# Altium schematic sheet Đề19.SchDoc
size A4; SheetNumber: 1; SheetTotal: 1; SPICEModelCacheGZZVKOJT: <root> / <DocumentId>GZZVKOJT</DocumentId> / <CacheFrame Number="0"> / <Model Name="fuse" Kind="CKT"> / <Text>.SUBCKT FUSE 1 2 PARAMS: CURRENT=1 RESISTANCE=1m / SW1 1 2 3 0 SMOD OFF / BNLV 3 0 V=(abs(v(1,2))) / .MODEL SMOD SW (VT={(CURRENT*RESISTANCE)} RON=1g ROFF={RESISTANCE}) / .ENDS FUSE</Text> / </Model> / <Model Name="diode" Kind="MDL"> / <Text>*Default Diode / *Diode Pinout: A,K / .MODEL DIODE D()</Text> / </Model> / <Model Name="skydiode" Kind="MDL"> / <Text>*Default Schottky Diode / *Schottky Diode Pinout: A,K / .MODEL SKYDIODE D(EG=0.69 XTI=2)</Text> / </Model> / <Model Name="irf1010" Kind="CKT"> / <Text>*IRF1010 MCE 4-2-96 / *55V  75A .014 ohm HEXFET pkg:TO-220 2,1,3 / .SUBCKT IRF1010  10 20 40 40 / M1   1  2  3  3  DMOS L=1U W=1U / RD  10  1  5.65M / RS  30  3  1.35M / RG  20  2  12.1 / CGS  2  3  2.15N / EGD 12  0  2  1  1 / VFB 14  0  0 / FFB  2  1  VFB  1 / CGD 13 14  4.49N / R1  13  0  1 / D1  12 13  DLIM / DDG 15 14  DCGD / R2  12 15  1 / D2  15  0  DLIM / DSD  3 10  DSUB / LS  30 40  7.5N / .MODEL DMOS NMOS (LEVEL=3 THETA=60M VMAX=114K ETA=2M VTO=3 KP=19.4) / .MODEL DCGD D (CJO=4.49N VJ=.6 M=.68) / .MODEL DSUB D (IS=311N N=1.5 RS=8.67M BV=55 CJO=4.08N VJ=.8 M=.42 TT=100N) / .MODEL DLIM D (IS=100U) / .ENDS IRF1010</Text> / </Model> / <Model Name="ni3wtrans" Kind="CKT"> / <Text>*Non-ideal 4-winding Transformer / *jjt created 18/1/2001. / *jjt 18/1/2002: changed LX2D,LX3D comments to match subcircuit parameters (X2D, X3D) to avoid possible confusion. / *Connections: / *                 Pri+ / *                 |   Pri- / *                 |   |   Sec1+ / *                 |   |   |   Sec1- / *                 |   |   |   |   Sec2+ / *                 |   |   |   |   |   Sec2- / *                 |   |   |   |   |   | / *                 |   |   |   |   |   | / *                 |   |   |   |   |   | / *                 |   |   |   |   |   | / .SUBCKT NI3WTRANS 1   2   3   4   5   6      PARAMS: RATIO1=1 RATIO2=1 RPRI=0.1 R2D=0.1 R3D=0.1 L1=1U / + X2D=1u X3D=1u XM=1k RCORE=1Meg / VISRC1   4 11 0V / VISRC2   6 14 0V / FCTRL1   10 2 VISRC1 {RATIO1} / FCTRL2   13 2 VISRC2 {RATIO2} / EVCVS1   3 11 10 2 {RATIO1} / EVCVS2   5 14 13 2 {RATIO2} / RRPRI    1 8 {RPRI} / RR2D    9 10 {R2D} / RR3D    12 13 {R3D} / LL1   8 7 {L1} / LX2D  7 9 {X2D} / LX3D  7 12 {X3D} / LXM   7 2 {XM} / RRCORE 7 2 {RCORE} / .ENDS NI3WTRANS</Text> / </Model> / </CacheFrame> / </root>
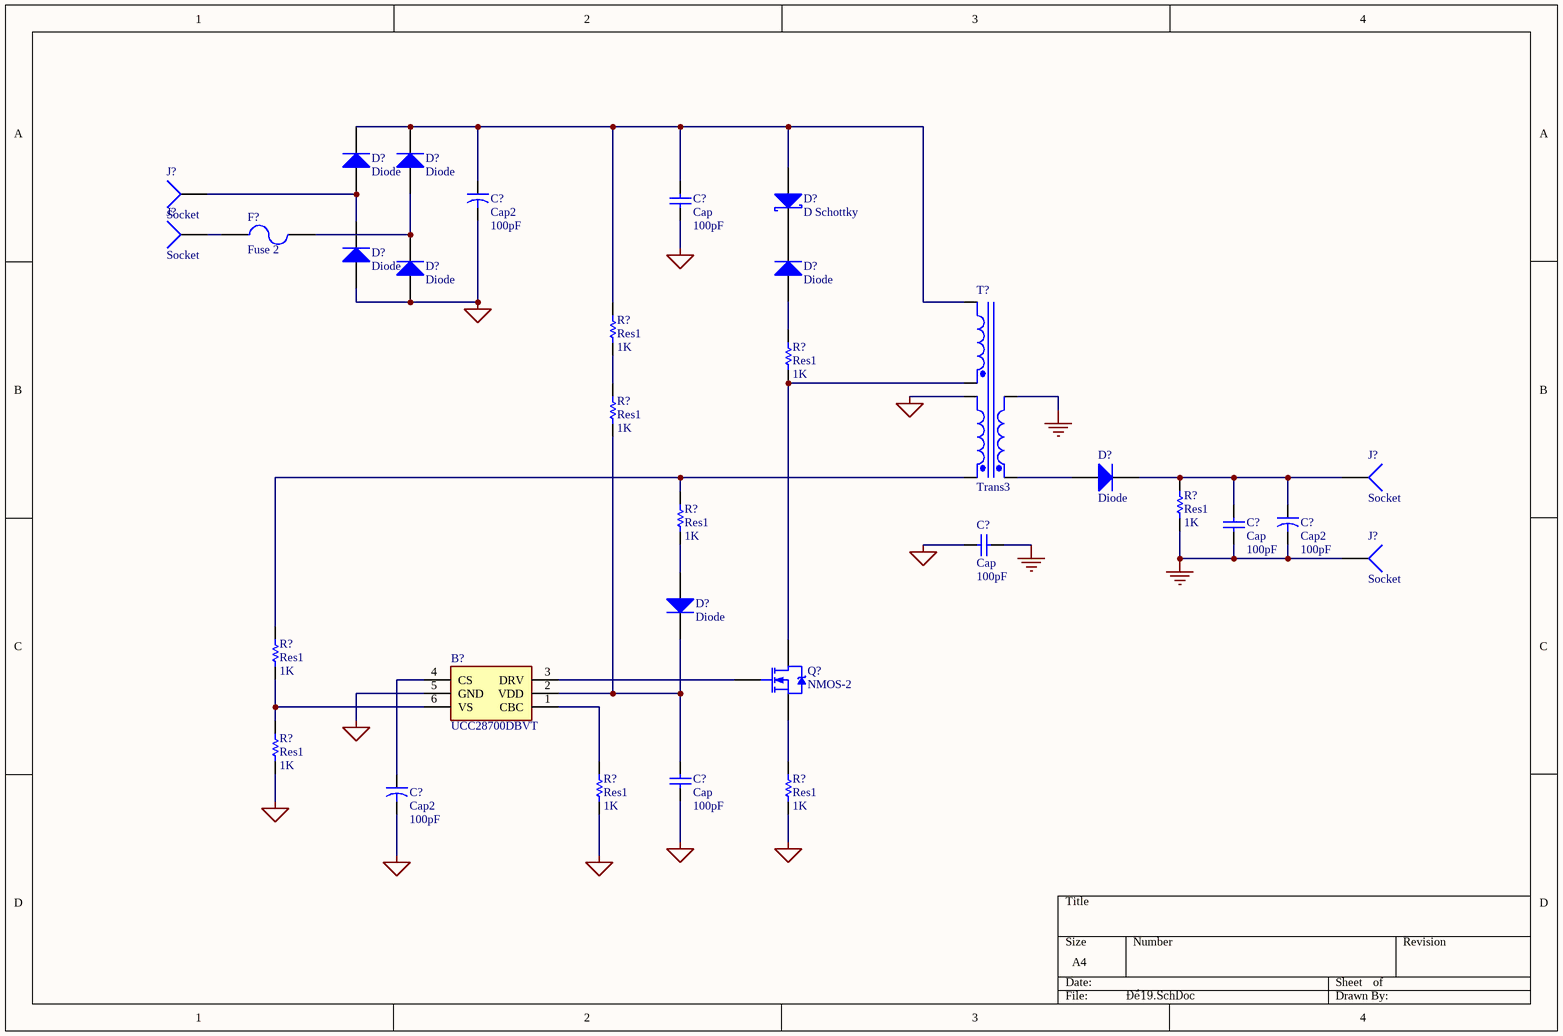
[diagram p0: Đề19.SchDoc]

## Parts
(Parts that share a designator on the sheet are numbered #1, #2 ... from top to bottom, then left to right.)
B?  UCC28700DBVT  [SOT95P280X145-6N]
C?#1  Cap2  value 100pF  [CAPR5-4X5]
C?#2  Cap  value 100pF  [RAD-0.3]
C?#3  Cap2  value 100pF  [CAPR5-4X5]
C?#4  Cap  value 100pF  [RAD-0.3]
C?#5  Cap  value 100pF  [RAD-0.3]
C?#6  Cap2  value 100pF  [CAPR5-4X5]
C?#7  Cap  value 100pF  [RAD-0.3]
D?#1  Diode  [SMC]
D?#2  Diode  [SMC]
D?#3  D Schottky  [SMB]
D?#4  Diode  [SMC]
D?#5  Diode  [SMC]
D?#6  Diode  [SMC]
D?#7  Diode  [SMC]
D?#8  Diode  [SMC]
F?  Fuse 2  [PIN-W2/E2.8]
J?#1  Socket  [PIN1]
J?#2  Socket  [PIN1]
J?#3  Socket  [PIN1]
J?#4  Socket  [PIN1]
Q?  NMOS-2  [TO-220AB]
R?#1  Res1  value 1K  [AXIAL-0.3]
R?#2  Res1  value 1K  [AXIAL-0.3]
R?#3  Res1  value 1K  [AXIAL-0.3]
R?#4  Res1  value 1K  [AXIAL-0.3]
R?#5  Res1  value 1K  [AXIAL-0.3]
R?#6  Res1  value 1K  [AXIAL-0.3]
R?#7  Res1  value 1K  [AXIAL-0.3]
R?#8  Res1  value 1K  [AXIAL-0.3]
R?#9  Res1  value 1K  [AXIAL-0.3]
T?  Trans3  [TRF_6]

## Nets
GND: B?.5(GND) C?#1.2 C?#2.1 C?#3.2 C?#4.1 C?#4.2 C?#5.1 C?#6.2 C?#7.1 D?#4.1(A) D?#5.1(A) J?#4.1 R?#4.1 R?#7.1 R?#8.1 R?#9.1 T?.2(Pri-) T?.4(Sec1-)
NetB?_1: B?.1(CBC) R?#8.2
NetB?_2: B?.2(VDD) C?#7.2 D?#8.2(K) R?#3.1
NetB?_3: B?.3(DRV) Q?.1(G)
NetB?_4: B?.4(CS) C?#6.1
NetB?_6: B?.6(VS) R?#6.1 R?#7.2
NetC?#1_1: C?#1.1 C?#2.2 D?#1.2(K) D?#2.2(K) D?#3.1(A) R?#1.2 T?.6(Sec2-)
NetC?#3_1: C?#3.1 C?#5.2 D?#7.2(K) J?#3.1 R?#4.2
NetD?#1_1: D?#1.1(A) D?#4.2(K) J?#1.1
NetD?#2_1: D?#2.1(A) D?#5.2(K) F?.2
NetD?#3_2: D?#3.2(K) D?#6.2(K)
NetD?#6_1: D?#6.1(A) R?#2.2
NetD?#7_1: D?#7.1(A) T?.1(Pri+)
NetD?#8_1: D?#8.1(A) R?#5.1
NetF?_1: F?.1 J?#2.1
NetQ?_2: Q?.2(D) R?#2.1 T?.5(Sec2+)
NetQ?_3: Q?.3(S) R?#9.2
NetR?#1_1: R?#1.1 R?#3.2
NetR?#5_2: R?#5.2 R?#6.2 T?.3(Sec1+)

## Library data of the parts
B? = UCC28700DBVT: Texas Instruments UCC28700DBVT, PWM Controller, 140 kHz, 6-Pin, SOT-23; Geometry.Height: 1.45mm; Manufacturer_Name: Texas Instruments; Manufacturer_Part_Number: UCC28700DBVT; Mouser Part Number: 595-UCC28700DBVT; Mouser Price/Stock: https://www.mouser.co.uk/ProductDetail/Texas-Instruments/UCC28700DBVT?qs=4whTb%2F0XQMhVrkFqriHNXg%3D%3D; Arrow Part Number: UCC28700DBVT; Arrow Price/Stock: https://www.arrow.com/en/products/ucc28700dbvt/texas-instruments?region=nac; Datasheet Link: http://www.ti.com/lit/gpn/ucc28700
C?#1 C?#3 C?#6 = Cap2: Capacitor; Published: 23-Sep-2002; PackageReference: CAPR5-4X5; Publisher: Altium Limited; PackageDescription: Capacitor; 2 Leads
C?#2 C?#4 C?#5 C?#7 = Cap: Capacitor; Published: 8-Jun-2000; LatestRevisionDate: 17-Jul-2002; LatestRevisionNote: Re-released for DXP Platform.; PackageReference: RAD-0.3; Publisher: Altium Limited; PackageDescription: Radial Cap, Thru-Hole; 2 Leads; 0.3 in Pin Spacing
D?#1 D?#2 D?#4-D?#8 = Diode: Default Diode; Published: 8-Jun-2000; LatestRevisionDate: 17-Jul-2002; LatestRevisionNote: Re-released for DXP Platform.; PackageVersion: Sep-1996; PackageReference: SMC; Publisher: Altium Limited; PackageDescription: DO-214-AB/SMC; 2 C-Bend Leads; Body 7.9 x 5.9 mm, inc. leads (LxW); Code_JEDEC: DO-214-AB
D?#3 = D Schottky: Schottky Diode; Published: 8-Jun-2000; LatestRevisionDate: 17-Jul-2002; LatestRevisionNote: Re-released for DXP Platform.; PackageReference: SMB; Publisher: Altium Limited; PackageDescription: DO-214-AA/SMB; 2 C-Bend Leads; Body 5.3 x 3.6 mm, inc. leads (LxW); Code_JEDEC: DO-214-AA
F? = Fuse 2: Fuse; Published: 8-Jun-2000; LatestRevisionDate: 17-Jul-2002; LatestRevisionNote: Re-released for DXP Platform.; PackageReference: PIN-W2/E2.8; Publisher: Altium Limited; PackageDescription: Thru-Hole; 2 Leads
Q? = NMOS-2: N-Channel Power MOSFET; Note: Pin 2 is electrically connected to pin 4.; Published: 8-Jun-2000; LatestRevisionDate: 17-Jul-2002; LatestRevisionNote: Re-released for DXP Platform.; DatasheetVersion: PD-9.814; PackageVersion: Feb-1997; PackageReference: TO-220AB; Publisher: Altium Limited; PackageDescription: TO, Thru-Hole, Vertical, Heatsink Mounted; 3 In-Line Leads; Pitch 2.54 mm; ComponentLink1Description: Manufacturer Link; ComponentLink1URL: http://www.irf.com/
R?#1-R?#9 = Res1: Resistor; Published: 8-Jun-2000; LatestRevisionDate: 17-Jul-2002; LatestRevisionNote: Re-released for DXP Platform.; PackageReference: AXIAL-0.3; Publisher: Altium Limited; PackageDescription: Axial Device, Thru-Hole; 2 Leads; 0.3 in Pin Spacing
T? = Trans3: Three-winding Transformer (Non-Ideal); Sim Note: Enter the turns ratios, Core loss resistance, Magnetising Reactance, Leakage Reactances and Resistances referred to the primary side into the parameter fields.; Published: 25-Jan-2001; LatestRevisionDate: 17-Jul-2002; LatestRevisionNote: Re-released for DXP Platform.; PackageReference: TRF_6; Publisher: Altium Limited; PackageDescription: Transformer; 6 Leads
J?#1-J?#4 = Socket: LatestRevisionDate: 17-Jul-2002; LatestRevisionNote: Re-released for DXP Platform.; Publisher: Altium Limited